# EAGLE schematic Board (EAGLE 7.3.0)

## Sheet 1 of 7
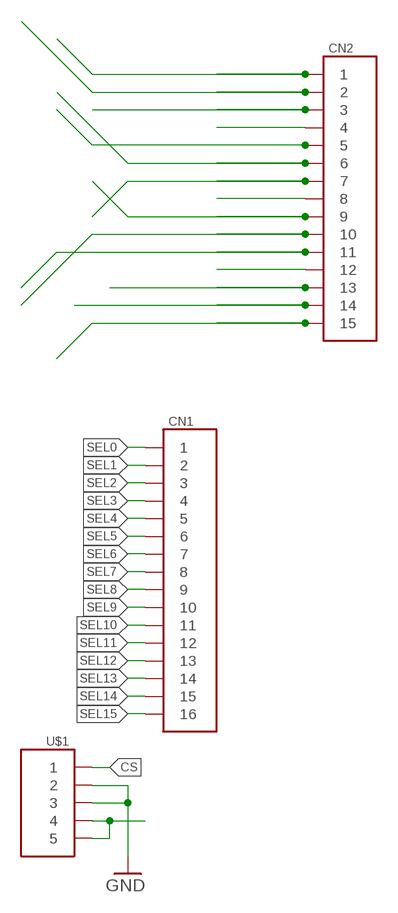
[diagram p0: schematic, sheet 1]

### Parts
CN1  HD16  [HD16]
CN2  HD15  [HD15]
U$1  HD5CN  [HD5]

### Nets
CS: U$1.P$1
GND: U$1.P$2 U$1.P$3 ; also sheet 2,4,6,7
N$180: U$1.P$4 U$1.P$5
OUT0: CN2.P$1
OUT1: CN2.P$2
OUT2: CN2.P$3
OUT3: CN2.P$4
OUT4: CN2.P$5
OUT5: CN2.P$6
OUT6: CN2.P$7
OUT7: CN2.P$8
OUT8: CN2.P$9
OUT9: CN2.P$10
OUT10: CN2.P$11
OUT11: CN2.P$12
OUT12: CN2.P$13
OUT13: CN2.P$14
OUT14: CN2.P$15
SEL0: CN1.P$1
SEL1: CN1.P$2
SEL2: CN1.P$3
SEL3: CN1.P$4
SEL4: CN1.P$5
SEL5: CN1.P$6
SEL6: CN1.P$7
SEL7: CN1.P$8
SEL8: CN1.P$9
SEL9: CN1.P$10
SEL10: CN1.P$11
SEL11: CN1.P$12
SEL12: CN1.P$13
SEL13: CN1.P$14
SEL14: CN1.P$15
SEL15: CN1.P$16

## Sheet 2 of 7
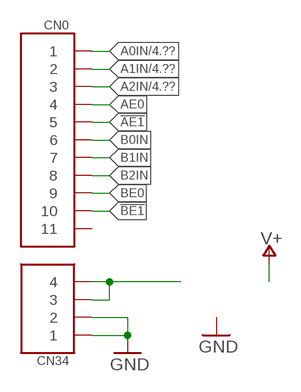
[diagram p1: schematic, sheet 2]

### Parts
CN0  HD11  [HD11]
CN34  HD4  [HD4]

### Nets
!AE1: CN0.P$5
!BE1: CN0.P$10
A0IN: CN0.P$1 ; also sheet 4
A1IN: CN0.P$2 ; also sheet 4
A2IN: CN0.P$3 ; also sheet 4
AE0: CN0.P$4
B0IN: CN0.P$6
B1IN: CN0.P$7
B2IN: CN0.P$8
BE0: CN0.P$9
GND: CN34.P$1 CN34.P$2 ; also sheet 1,4,6,7
N$129: CN34.P$3 CN34.P$4
Unconnected: CN0.P$11

## Sheet 3 of 7
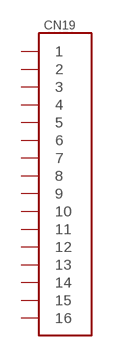
[diagram p2: schematic, sheet 3]

### Parts
CN19  HD16  [HD16]
Unconnected: CN19.P$1 CN19.P$2 CN19.P$3 CN19.P$4 CN19.P$5 CN19.P$6 CN19.P$7 CN19.P$8 CN19.P$9 CN19.P$10 CN19.P$11 CN19.P$12 CN19.P$13 CN19.P$14 CN19.P$15 CN19.P$16

## Sheet 4 of 7
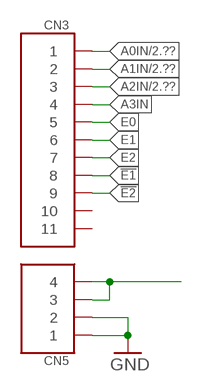
[diagram p3: schematic, sheet 4]

### Parts
CN3  HD11  [HD11]
CN5  HD4  [HD4]

### Nets
!E1: CN3.P$8
!E2: CN3.P$9
A0IN: CN3.P$1 ; also sheet 2
A1IN: CN3.P$2 ; also sheet 2
A2IN: CN3.P$3 ; also sheet 2
A3IN: CN3.P$4
E0: CN3.P$5
E1: CN3.P$6
E2: CN3.P$7
GND: CN5.P$1 CN5.P$2 ; also sheet 1,2,6,7
N$1243: CN5.P$3 CN5.P$4
Unconnected: CN3.P$10 CN3.P$11

## Sheet 5 of 7
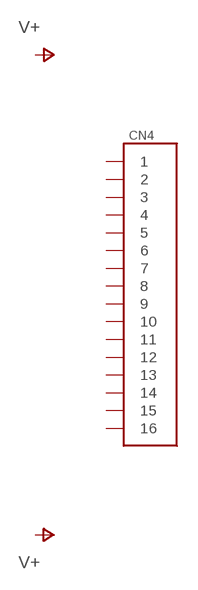
[diagram p4: schematic, sheet 5]

### Parts
CN4  HD16  [HD16]
Unconnected: CN4.P$1 CN4.P$2 CN4.P$3 CN4.P$4 CN4.P$5 CN4.P$6 CN4.P$7 CN4.P$8 CN4.P$9 CN4.P$10 CN4.P$11 CN4.P$12 CN4.P$13 CN4.P$14 CN4.P$15 CN4.P$16

## Sheet 6 of 7
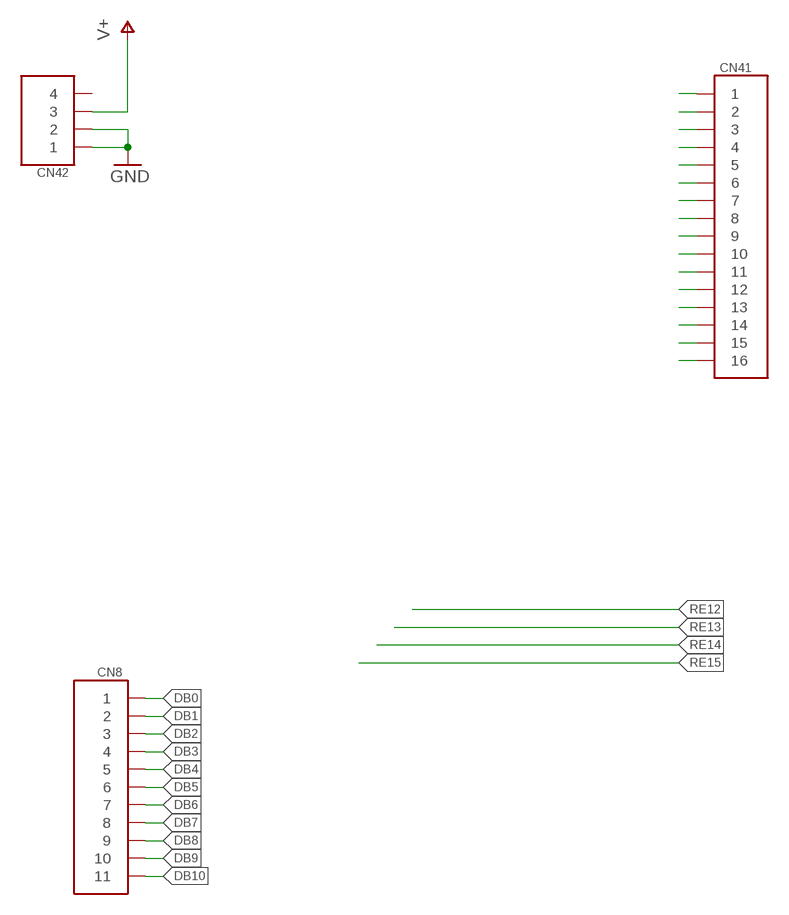
[diagram p5: schematic, sheet 6]

### Parts
CN8  HD11  [HD11]
CN41  HD16  [HD16]
CN42  HD4  [HD4]

### Nets
DB0: CN8.P$1
DB1: CN8.P$2
DB2: CN8.P$3
DB3: CN8.P$4
DB4: CN8.P$5
DB5: CN8.P$6
DB6: CN8.P$7
DB7: CN8.P$8
DB8: CN8.P$9
DB9: CN8.P$10
DB10: CN8.P$11
GND: CN42.P$1 CN42.P$2 ; also sheet 1,2,4,7
SEL16: CN41.P$1
SEL17: CN41.P$2
SEL18: CN41.P$3
SEL19: CN41.P$4
SEL20: CN41.P$5
SEL21: CN41.P$6
SEL22: CN41.P$7
SEL23: CN41.P$8
SEL24: CN41.P$9
SEL25: CN41.P$10
SEL26: CN41.P$11
SEL27: CN41.P$12
SEL28: CN41.P$13
SEL29: CN41.P$16
SEL30: CN41.P$15
SEL31: CN41.P$14
V+: CN42.P$3 ; also sheet 2,7
Unconnected: CN42.P$4

## Sheet 7 of 7
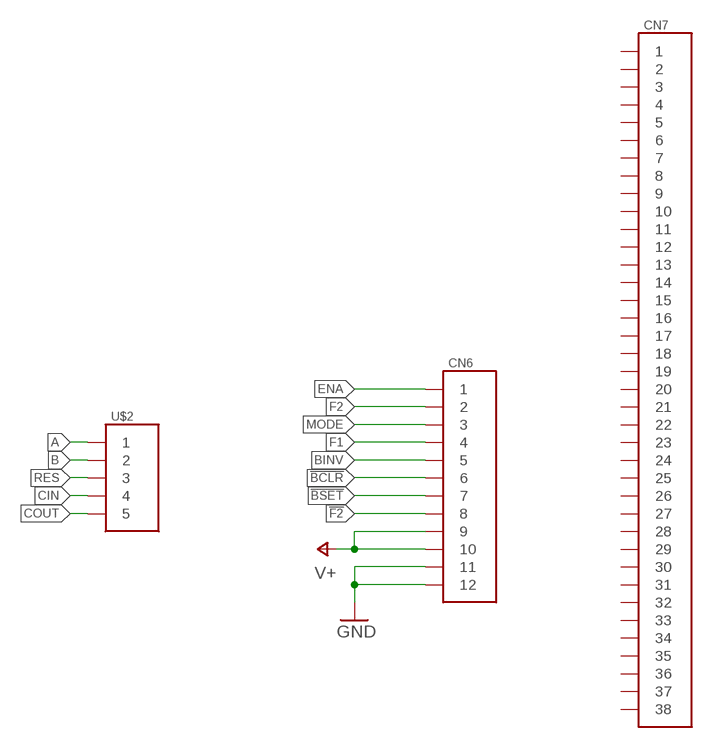
[diagram p6: schematic, sheet 7]

### Parts
CN6  HD12  [HD12]
CN7  HD38-HP  [HD38-HOLEPAD]
U$2  HD5CN  [HD5]

### Nets
!BCLR: CN6.P$6
!BSET: CN6.P$7
!F2: CN6.P$8
A: U$2.P$1
B: U$2.P$2
BINV: CN6.P$5
CIN: U$2.P$4
COUT: U$2.P$5
ENA: CN6.P$1
F1: CN6.P$4
F2: CN6.P$2
GND: CN6.P$11 CN6.P$12 ; also sheet 1,2,4,6
MODE: CN6.P$3
RES: U$2.P$3
V+: CN6.P$9 CN6.P$10 ; also sheet 2,6
Unconnected: CN7.P1@1 CN7.P1@2 CN7.P2@1 CN7.P2@2 CN7.P3@1 CN7.P3@2 CN7.P4@1 CN7.P4@2 CN7.P5@1 CN7.P5@2 CN7.P6@1 CN7.P6@2 CN7.P7@1 CN7.P7@2 CN7.P8@1 CN7.P8@2 CN7.P9@1 CN7.P9@2 CN7.P10@1 CN7.P10@2 CN7.P11@1 CN7.P11@2 CN7.P12@1 CN7.P12@2 CN7.P13@1 CN7.P13@2 CN7.P14@1 CN7.P14@2 CN7.P15@1 CN7.P15@2 CN7.P16@1 CN7.P16@2 CN7.P17@1 CN7.P17@2 CN7.P18@1 CN7.P18@2 CN7.P19@1 CN7.P19@2 CN7.P20@1 CN7.P20@2 CN7.P21@1 CN7.P21@2 CN7.P22@1 CN7.P22@2 CN7.P23@1 CN7.P23@2 CN7.P24@1 CN7.P24@2 CN7.P25@1 CN7.P25@2 CN7.P26@1 CN7.P26@2 CN7.P27@1 CN7.P27@2 CN7.P28@1 CN7.P28@2 CN7.P29@1 CN7.P29@2 CN7.P30@1 CN7.P30@2 CN7.P31@1 CN7.P31@2 CN7.P32@1 CN7.P32@2 CN7.P33@1 CN7.P33@2 CN7.P34@1 CN7.P34@2 CN7.P35@1 CN7.P35@2 CN7.P36@1 CN7.P36@2 CN7.P37@1 CN7.P37@2 CN7.P38@1 CN7.P38@2

## Library data of the parts
CN0 CN3 CN8 = SmallRoomLabs_ConSwitch:HD11
CN1 CN4 CN19 CN41 = SmallRoomLabs_ConSwitch:HD16
CN2 = SmallRoomLabs_ConSwitch:HD15
CN5 CN34 CN42 = SmallRoomLabs_ConSwitch:HD4
CN6 = SmallRoomLabs_ConSwitch:HD12
CN7 = SmallRoomLabs_ConSwitch:HD38
U$1 U$2 = SmallRoomLabs_ConSwitch:HD5

## Net classes
0 default: width 0.305 mm, drill 0.305 mm, clearance 0.305 mm
1 PWR: width 0.203 mm, drill 0.305 mm, clearance 0.203 mm